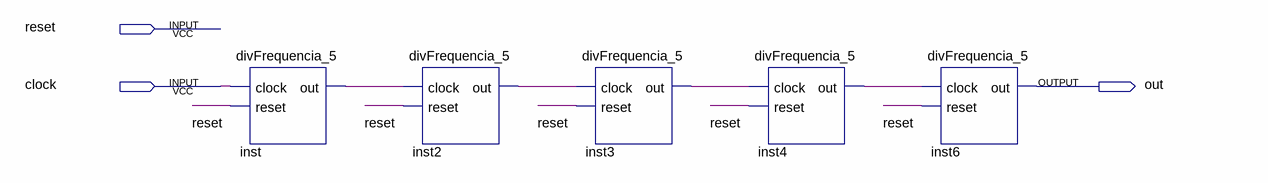
[diagram p0: schematic sheet]
// Quartus schematic divFrequencia_25.bdf as structural Verilog: 5 symbols, 3 pins
module divFrequencia_25 (
  input  reset,
  input  clock,
  output out
);

  wire inst2_out, inst3_out, inst4_out, inst_out;

  divFrequencia_5 inst (.clock(clock), .reset(reset), .out(inst_out));
  divFrequencia_5 inst2 (.clock(inst_out), .reset(reset), .out(inst2_out));
  divFrequencia_5 inst3 (.clock(inst2_out), .reset(reset), .out(inst3_out));
  divFrequencia_5 inst4 (.clock(inst3_out), .reset(reset), .out(inst4_out));
  divFrequencia_5 inst6 (.clock(inst4_out), .reset(reset), .out(out));
endmodule
